# Altium schematic sheet x_power.SchDoc
size A; SheetNumber: 8; SheetTotal: 8
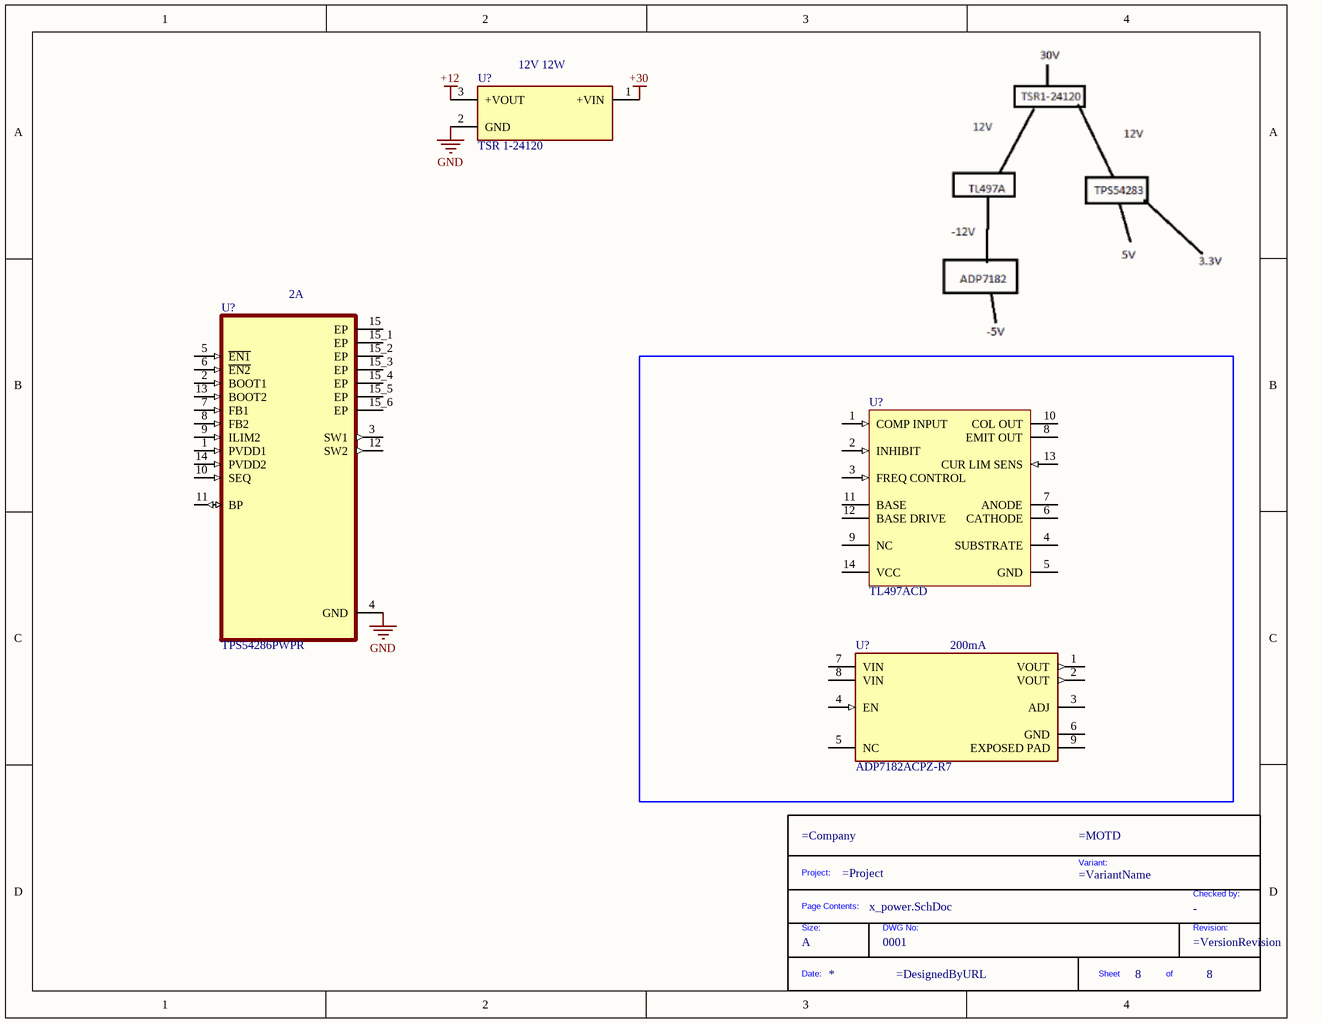
[diagram p0: x_power.SchDoc]

## Parts
(Parts that share a designator on the sheet are numbered #1, #2 ... from top to bottom, then left to right.)
*?  DWG No: 0001  Size: A  (hidden comment: TitleBlock)  (graphical)
U?#1  TSR 1-24120  [FP-TSR_1-24120-MFG]
U?#2  TL497ACD  [D0014A_N]
U?#3  TPS54286PWPR  [IC_TPS27S100BPWPR]
U?#4  ADP7182ACPZ-R7  [FP-CP-8-13-IPC_B]

## Blocks framed on the sheet
200mA: U?#2 U?#4

## Nets
+12: U?#1.3(+VOUT)
+30: U?#1.1(+VIN)
GND: U?#1.2(GND) U?#3.4(GND)

Not connected (* = marked no-connect by the designer): U?#2 1(COMP_INPUT) 2(INHIBIT) 3(FREQ_CONTROL) 4(SUBSTRATE) 5(GND) 6(CATHODE) 7(ANODE) 8(EMIT_OUT) 9(NC) 10(COL_OUT) 11(BASE) 12(BASE_DRIVE) 13(CUR_LIM_SENS) 14(VCC); U?#3 1(PVDD1) 2(BOOT1) 3(SW1) 5(~{EN1}) 6(~{EN2}) 7(FB1) 8(FB2) 9(ILIM2) 10(SEQ) 11(BP) 12(SW2) 13(BOOT2) 14(PVDD2) 15(EP) 15_1(EP) 15_2(EP) 15_3(EP) 15_4(EP) 15_5(EP) 15_6(EP); U?#4 1(VOUT) 2(VOUT) 3(ADJ) 4(EN) 5(NC) 6(GND) 7(VIN) 8(VIN) 9(EXPOSED_PAD)

## Notes on the sheet
- (near U?#1) 12V 12W
- (near U?#3) 2A
- (in symbol TitleBlock) Project:; Variant:; Checked by:; Page Contents:; Size:; DWG No:; Revision:; Date:; Sheet; of

## Library data of the parts
*? = TitleBlock: Standard Title Block; Checked by: -
U?#1 = CMP-49942-000012-1: DC DC CONVERTER 12V 12W; Min Input Voltage (DC): 15V; Isolation: Isolated; Efficiency: 91%; Number of Outputs: 1; Max Input Voltage: 36V; Output Current: 1A; Max Input Voltage (DC): 32V; Length: 11.7mm; Mount: Through Hole; Output Voltage: 12V; Nominal Output Voltage: 12V; Depth: 11.7mm; Min Operating Temperature: -40°C; Number of Pins: 3; Series: TSR 1; Radiation Hardening: No; Max Operating Temperature: 85°C; REACH SVHC: No SVHC; Case/Package: SIP; Max Output Power: 12W; RoHS Compliant: Yes; Weight: 1.9g; Height: 10.2mm; Width: 7.6mm; Min Input Voltage: 15V; Power Rating: 12W; Max Output Current: 1A
U?#2 = CMP-0344-00008-2: Inverting Buck-Boost Regulator with 4.5 to 12 V Input and -25 to 30 V Output, 0 to 70 degC, 14-Pin SOIC (D), Green (RoHS & no Sb/Br); Manufacturer: Texas Instruments; Vout(Max)(V): 30; Iout(Max)(A): 0.5; Vin(Min)(V): 4.5; Vin(Max)(V): 12; SubFamily: Inverting Regulator; Regulated Outputs(#): 1; Iq(Typ)(mA): 11; ComponentLink1URL: http://www.ti.com/general/docs/lit/getliterature.tsp?genericPartNumber=TL497A&fileType=pdf; ComponentLink2Description: Package Specification; DatasheetVersion: SLVS009F; PackageDescription: 14-Pin Plastic Small Outline Integrated Circuit, 8.7 x 3.9 mm, Pitch 1.27 mm Pitch; Vout(Min)(V): -25; ComponentLink1Description: Datasheet; PartNumber: TL497ACD; Topology: Inverting Buck-Boost; Switch Current Limit(Typ)(A): 0.5; PackageVersion: revM, Jun-2011; ComponentLink2URL: http://www.ti.com/lit/ml/mpds177g/mpds177g.pdf; PackageReference: D0014A; Eco-Plan: Green (RoHS & no Sb/Br); Code_JEDEC: MS-012AB; Mounting Technology: Surface Mount
U?#3 = TPS54286PWPR: MF: {'manufacturer': u'Texas Instruments'}; Price: None; MP: TPS54286PWPR; Availability: Unavailable; Value: *; Package: None
U?#4 = CMP-09138-000076-1: IC REG LIN NEG ADJ 200MA 8LFCSP; Number of Outputs: 1; Min Output Voltage: -2.7V; Min Current Limit: 230mA; Max Input Voltage: -28V; Reference Voltage: -1.22V; Output Voltage: -27V; Max Supply Current: -650uA; Power Supply Rejection Ratio (PSRR): 45dB; Accuracy: 1%; Max Output Voltage: -25.3V; Max Output Current: -200mA; Output Type: Adjustable; Polarity: Negative; Dropout Voltage: 185mV; Contact Plating: Tin; REACH SVHC: No SVHC; Width: 3.1mm; Case/Package: LFCSP EP; Package Quantity: 1500; Output Voltage Accuracy: 1%; Lead Free: Contains Lead; Number of Pins: 8; RoHS Compliant: Yes; Quiescent Current: -650uA; Number of Regulators: 1; Output Current: 200mA; Packaging: Tape and Reel; Min Input Voltage: -2.7V; Mount: Surface Mount; Length: 3.1mm; Min Operating Temperature: -40°C; Height: 0.75mm; Max Operating Temperature: 125°C